# EAGLE schematic untitled (EAGLE 8.0.1)
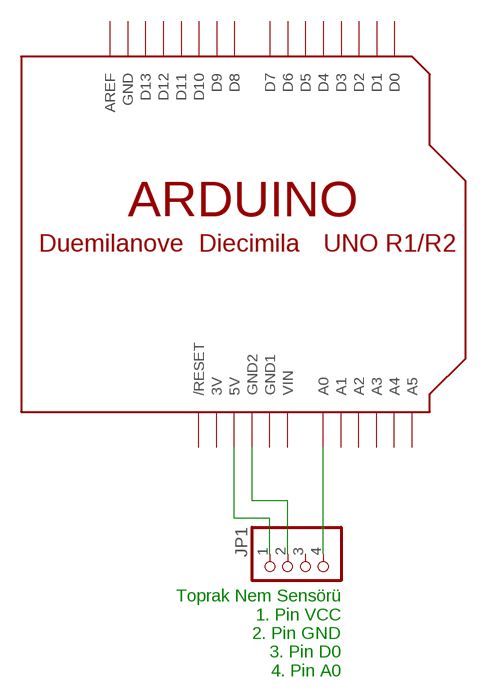
[diagram p0: schematic, sheet 1]

## Parts
JP1  PINHD-1X4/90  [1X04/90]
U$1  ARDUINOUNO  [ARDUINO]

## Nets
N$1: JP1.1 U$1.5V
N$2: JP1.2 U$1.GND2
N$3: JP1.4 U$1.A0
Unconnected: JP1.3 U$1.A1 U$1.A2 U$1.A3 U$1.A4 U$1.A5 U$1.AREF U$1.D0 U$1.D1 U$1.D2 U$1.D3 U$1.D4 U$1.D5 U$1.D6 U$1.D7 U$1.D8 U$1.D9 U$1.D10 U$1.D11 U$1.D12 U$1.D13 U$1.RESET(/RESET)

## Notes on the sheet
- Toprak Nem Sensörü
  1. Pin VCC
  2. Pin GND
  3. Pin D0
  4. Pin A0

## Power pins joined to a net without a drawn wire
3V: U$1.3V
GND: U$1.GND
GND1: U$1.GND1
VIN: U$1.VIN

## Library data of the parts
JP1 = pinhead:PINHD-1X4: PIN HEADER
U$1 = adafruit:ARDUINO: Arduino Diecimila/Duemilanove Make a shield with ease, this package has all the named pins as well as the two mounting drill holes and an outline of the USB and DC power connector. The outline is on the DIMENSION layer, so if your board house uses it they will cut the outline to match. http://www.ladyada.net/library/pcb/eaglelibrary.html